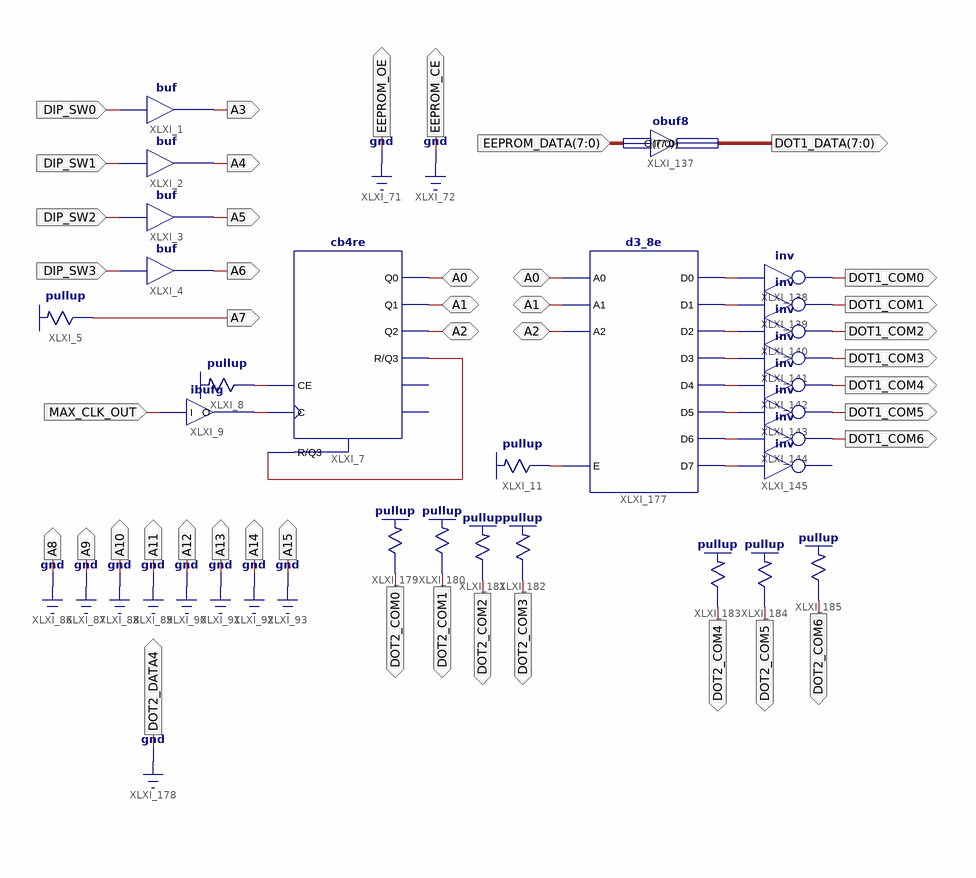
[diagram p0: schematic sheet 1]
// Xilinx ISE schematic lab9_rom3.sch (spartan3) as structural Verilog: 26 symbols, 40 ports
module lab9_rom3 (
  input  DIP_SW0,
  input  DIP_SW1,
  input  DIP_SW2,
  input  DIP_SW3,
  input  MAX_CLK_OUT,
  input  [7:0] EEPROM_DATA,
  inout  A0,
  inout  A1,
  inout  A2,
  output A3,
  output A4,
  output A5,
  output A6,
  output A7,
  output EEPROM_OE,
  output EEPROM_CE,
  output A12,
  output A13,
  output A15,
  output A14,
  output A11,
  output A10,
  output A9,
  output A8,
  output DOT2_COM0,
  output DOT2_COM1,
  output [7:0] DOT1_DATA,
  output DOT1_COM0,
  output DOT1_COM2,
  output DOT1_COM3,
  output DOT1_COM4,
  output DOT1_COM5,
  output DOT1_COM6,
  output DOT1_COM1,
  output DOT2_COM2,
  output DOT2_COM3,
  output DOT2_COM4,
  output DOT2_COM5,
  output DOT2_COM6,
  output DOT2_DATA4
);

  wire XLXN_12, XLXN_13, XLXN_15, XLXN_17, XLXN_235, XLXN_236, XLXN_237, XLXN_238, XLXN_239, XLXN_240,
       XLXN_241, XLXN_242;

  buf XLXI_1 (A3, DIP_SW0);
  buf XLXI_2 (A4, DIP_SW1);
  buf XLXI_3 (A5, DIP_SW2);
  buf XLXI_4 (A6, DIP_SW3);
  \pullup  XLXI_5 (.O(A7));
  \pullup  XLXI_8 (.O(XLXN_12));
  ibufg XLXI_9 (.I(MAX_CLK_OUT), .O(XLXN_13));
  cb4re XLXI_7 (.C(XLXN_13), .CE(XLXN_12), .R(XLXN_15), .Q0(A0), .Q1(A1), .Q2(A2), .Q3(XLXN_15));  // open: CEO, TC
  obuf8 XLXI_137 (.I(EEPROM_DATA), .O(DOT1_DATA));
  not XLXI_138 (DOT1_COM0, XLXN_235);
  not XLXI_139 (DOT1_COM1, XLXN_236);
  not XLXI_140 (DOT1_COM2, XLXN_237);
  not XLXI_141 (DOT1_COM3, XLXN_238);
  not XLXI_142 (DOT1_COM4, XLXN_239);
  not XLXI_143 (DOT1_COM5, XLXN_240);
  not XLXI_144 (DOT1_COM6, XLXN_241);
  // inv XLXI_145 has open pins: I=XLXN_242, O=open
  \pullup  XLXI_11 (.O(XLXN_17));
  d3_8e XLXI_177 (
    .A0(A0), .A1(A1), .A2(A2), .E(XLXN_17), .D0(XLXN_235), .D1(XLXN_236), .D2(XLXN_237), .D3(XLXN_238),
    .D4(XLXN_239), .D5(XLXN_240), .D6(XLXN_241), .D7(XLXN_242));
  \pullup  XLXI_179 (.O(DOT2_COM0));
  \pullup  XLXI_180 (.O(DOT2_COM1));
  \pullup  XLXI_181 (.O(DOT2_COM2));
  \pullup  XLXI_182 (.O(DOT2_COM3));
  \pullup  XLXI_183 (.O(DOT2_COM4));
  \pullup  XLXI_184 (.O(DOT2_COM5));
  \pullup  XLXI_185 (.O(DOT2_COM6));

  assign A8 = 1'b0;
  assign A9 = 1'b0;
  assign A10 = 1'b0;
  assign A11 = 1'b0;
  assign A12 = 1'b0;
  assign A13 = 1'b0;
  assign A14 = 1'b0;
  assign A15 = 1'b0;
  assign DOT2_DATA4 = 1'b0;
  assign EEPROM_CE = 1'b0;
  assign EEPROM_OE = 1'b0;
endmodule
